# EAGLE design color sensor (EAGLE 9.4.2)
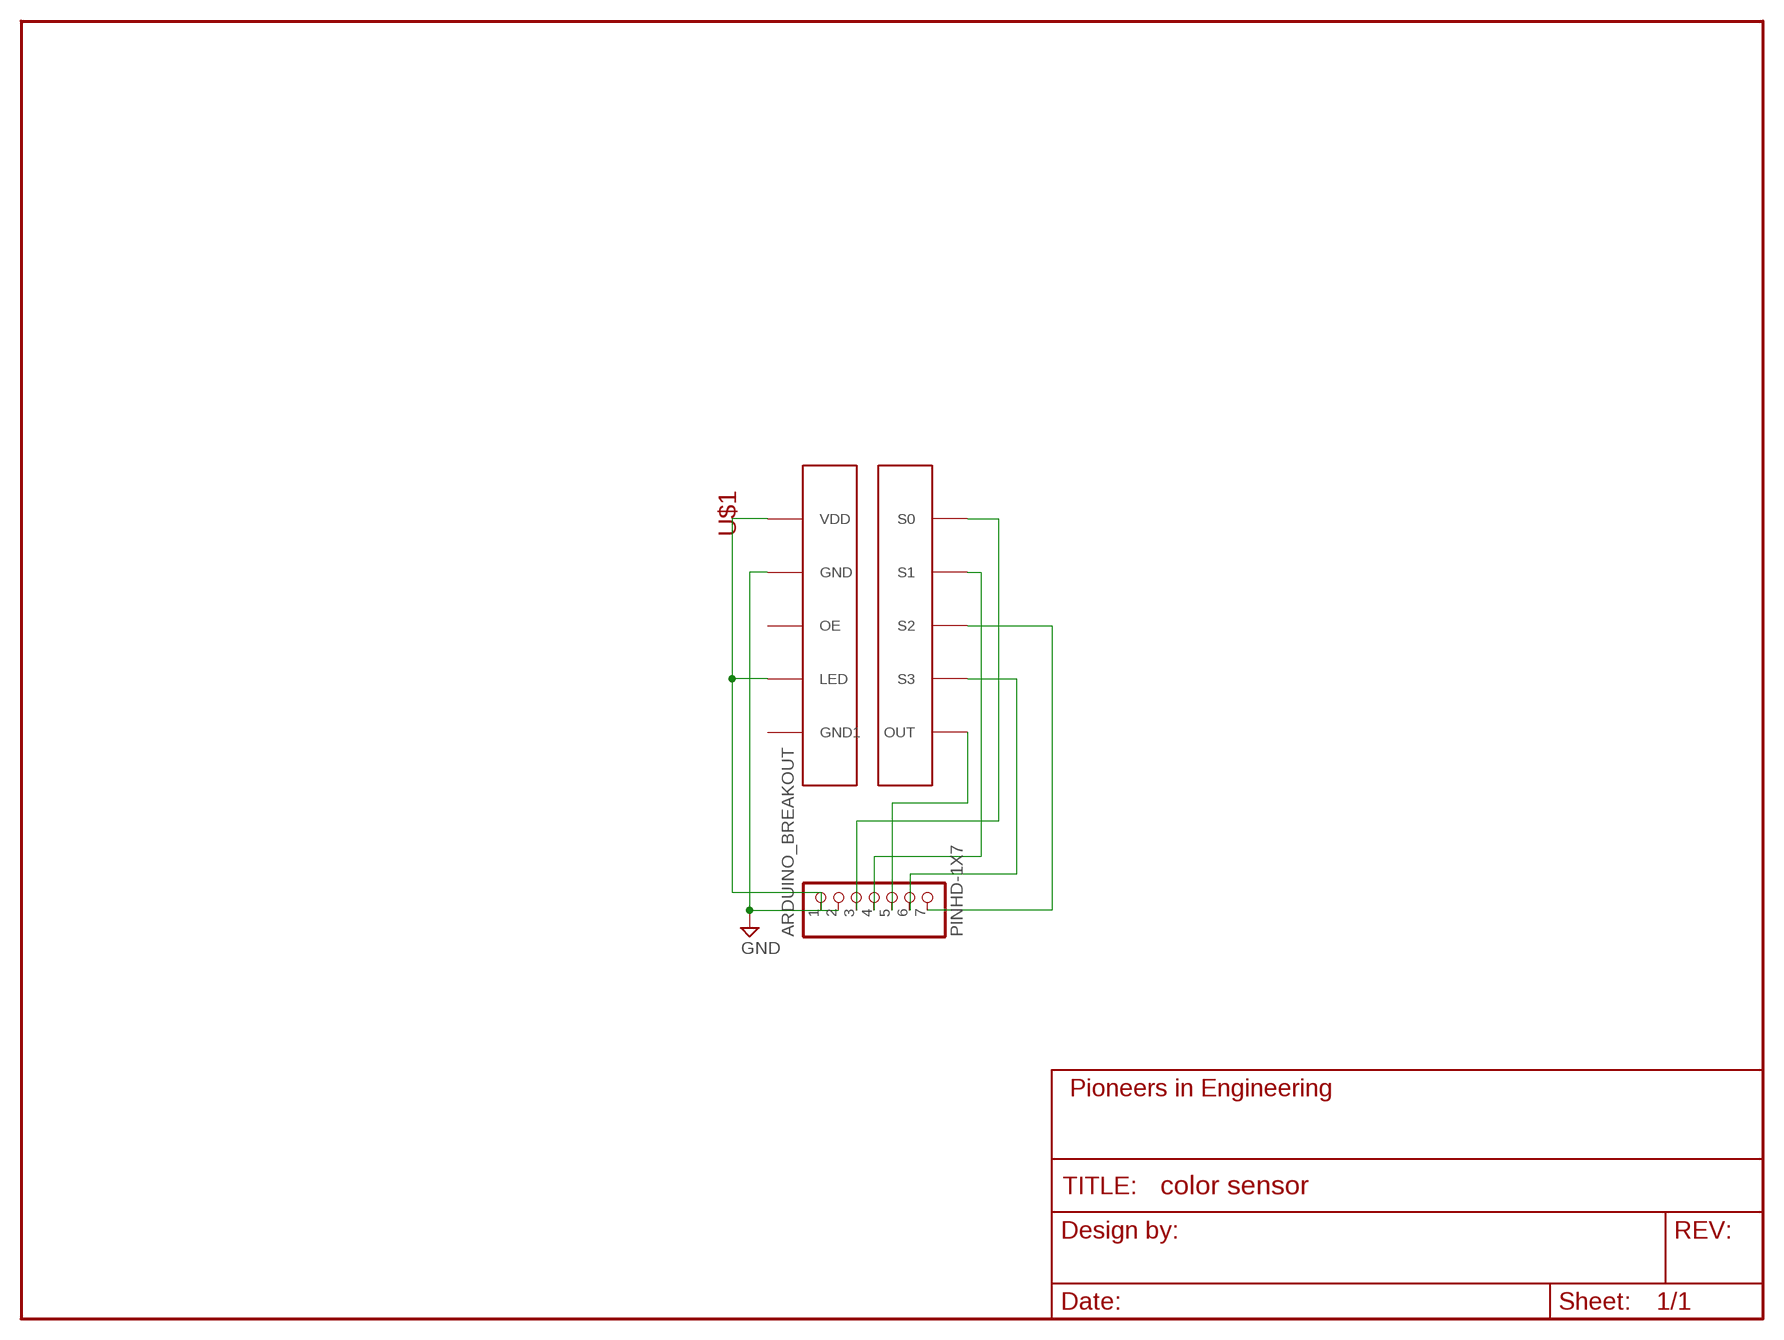
[diagram p0: schematic, sheet 1]

## Parts
ARDUINO_BREAKOUT  PINHD-1X7  [1X07]
U$1  COLOR_SENSOR  [COLOR_SENSOR]

## Nets
GND: ARDUINO_BREAKOUT.2 U$1.P9(GND)
N$1: ARDUINO_BREAKOUT.1 U$1.P7(LED) U$1.P10(VDD)
N$3: ARDUINO_BREAKOUT.3 U$1.P5(S0)
N$4: ARDUINO_BREAKOUT.4 U$1.P4(S1)
N$5: ARDUINO_BREAKOUT.7 U$1.P3(S2)
N$6: ARDUINO_BREAKOUT.6 U$1.P2(S3)
N$7: ARDUINO_BREAKOUT.5 U$1.P1(OUT)
Unconnected: U$1.P6(GND1) U$1.P8(OE)

## Library data of the parts
ARDUINO_BREAKOUT = pie:PINHD-1X7: 7-pin 0.1-inch header; DIGIKEY-PN: 3M9326-ND
U$1 = pie:COLOR_SENSOR: Color sensor

## Board
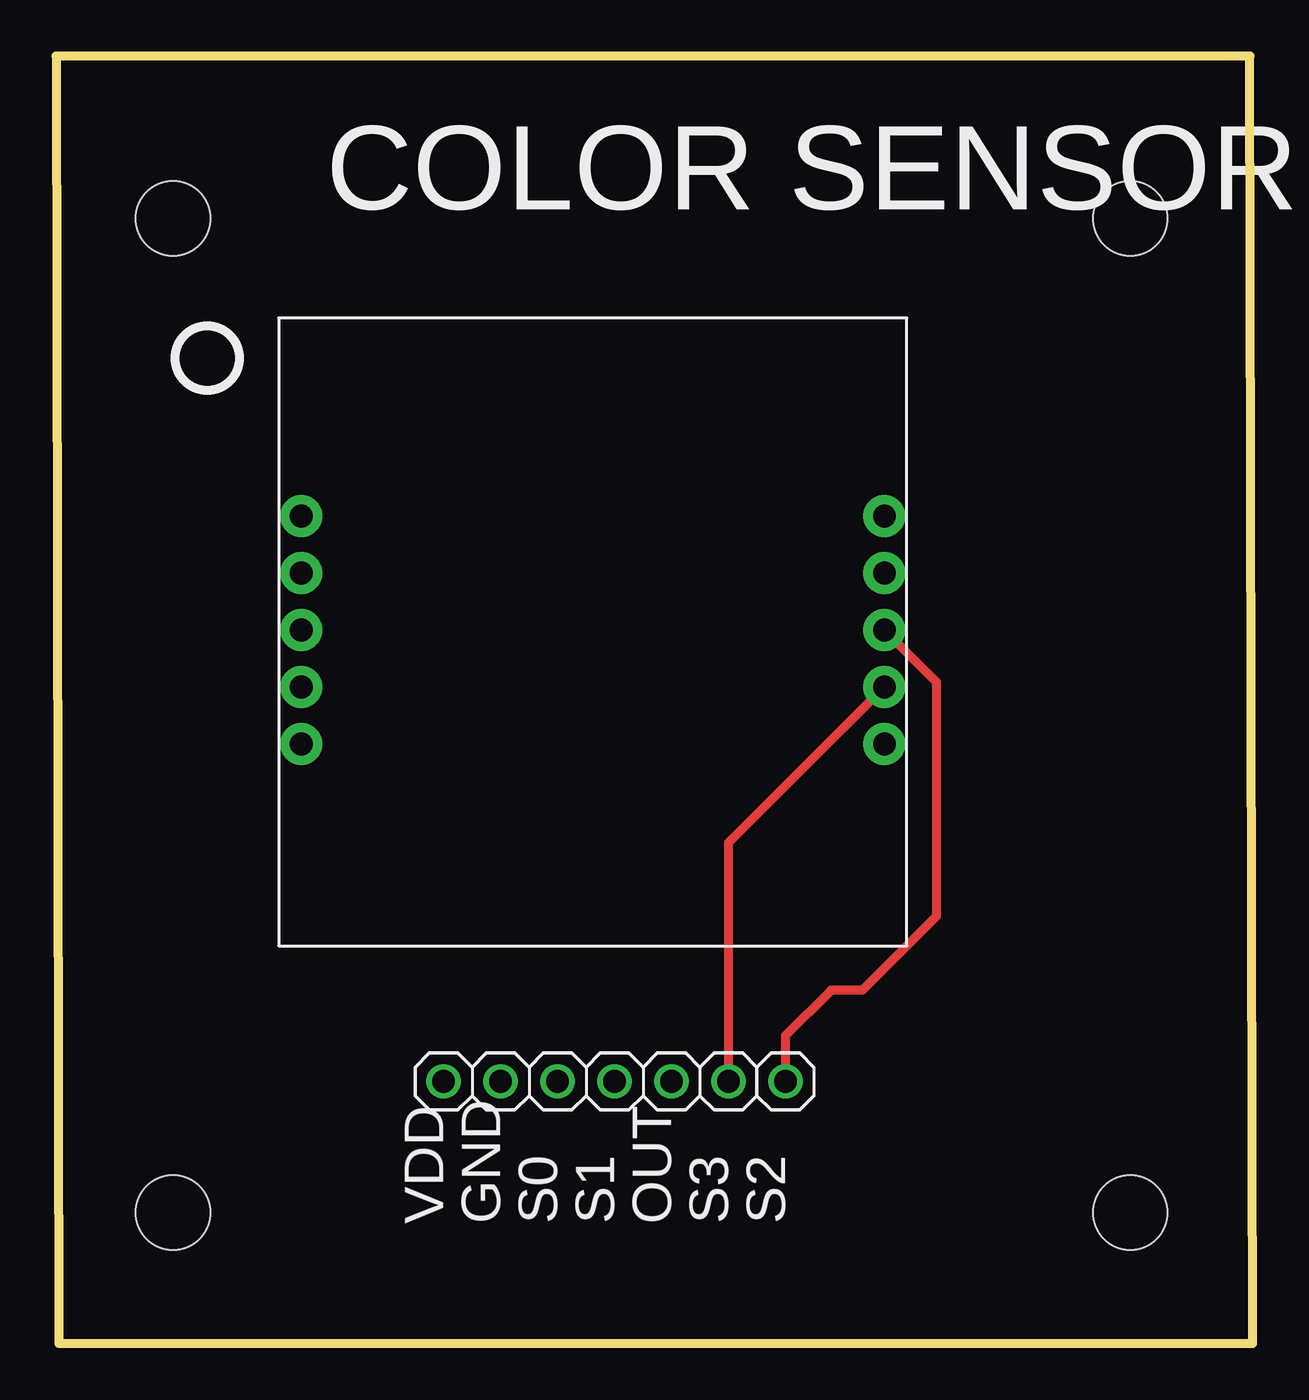
[diagram p1: board, top side]
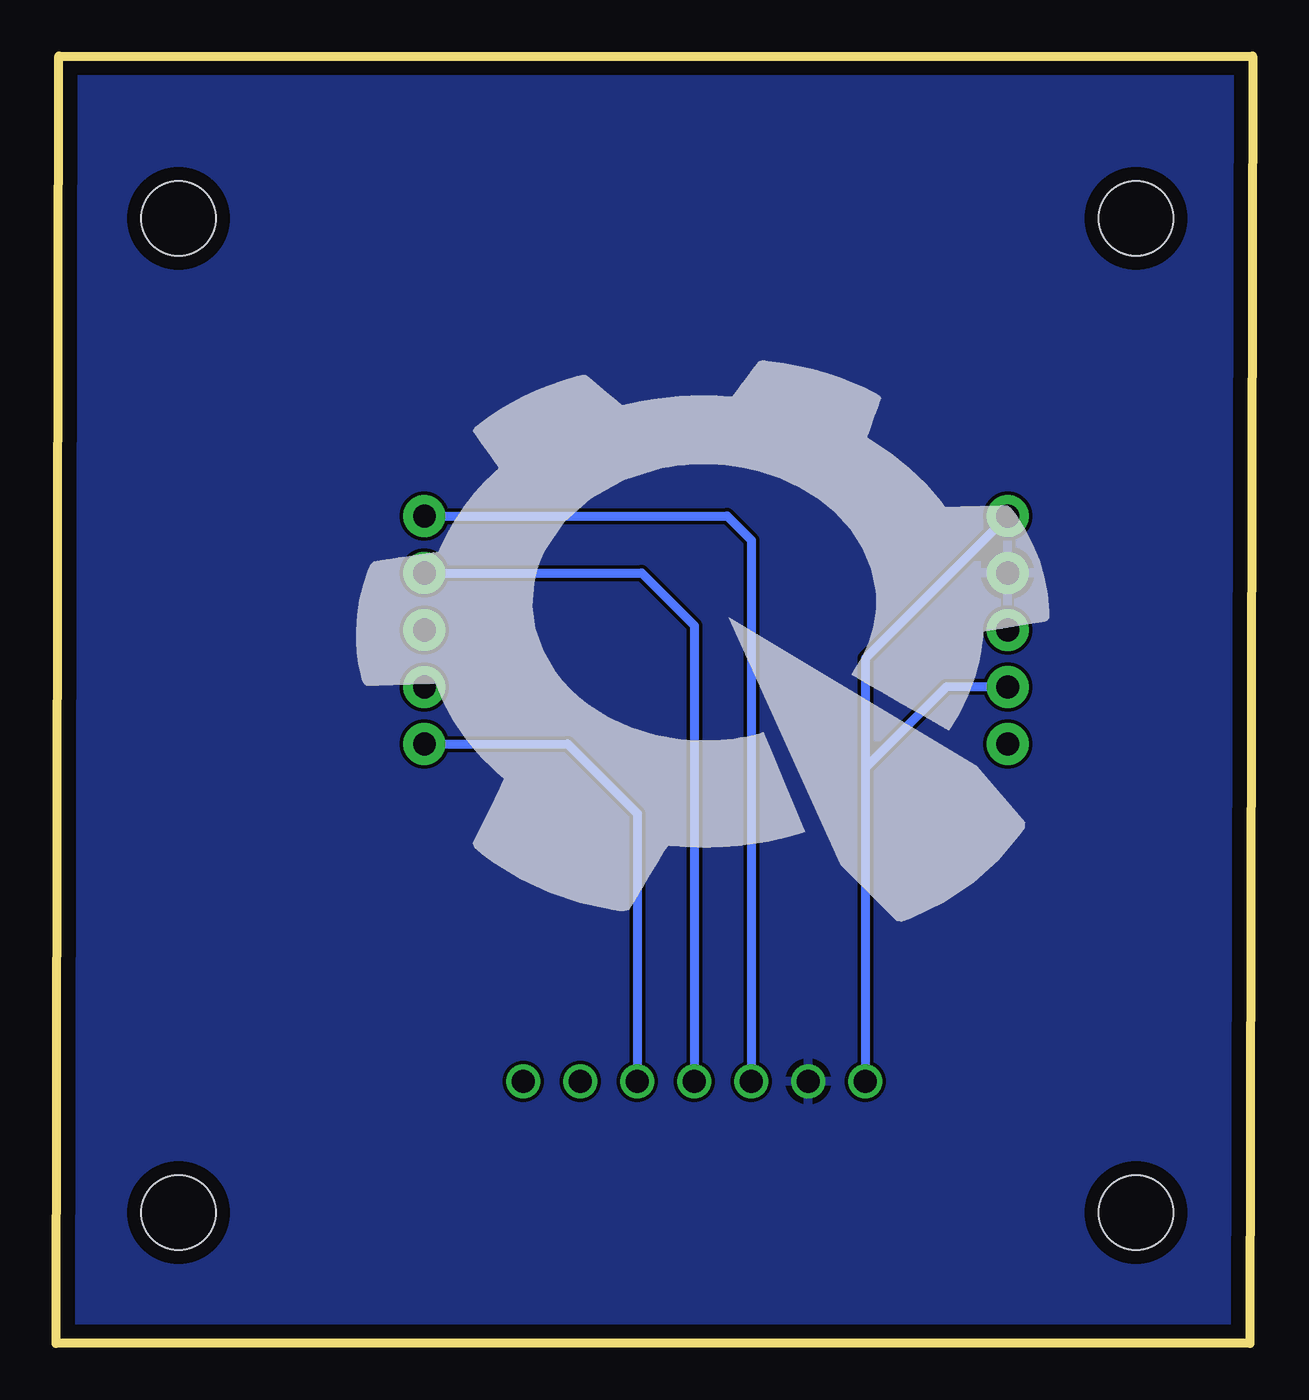
[diagram p2: board, bottom side, seen from below]

Size 53.34 x 57.4 mm. Coordinates in mm from the lower left corner, seen from the top.
Outline: 0,57.4 0.13,0 53.34,0 53.21,57.4 0,57.4
Copper layers (1*16): Top 2mil / dielectric 9mil / Bottom 2mil
Design rules "pie": minimum track width 6mil, minimum drill 15mil, track to track 6mil, track to pad 6mil, pad to pad 6mil, via to via 6mil, smd to smd 6mil, copper to edge 25mil, drill to drill 7mil, minimum pad ring 7mil, minimum via ring 7mil, stop-mask expansion 3mil, vias tented up to drill 21mil, thermal gap 10mil

### Footprints (pad centres in the part's own frame; a part is rotated, then mirrored left to right if it is on the bottom)
1X07 = drill 1.016 pad 1.524: 1 -7.62,0; 2 -5.08,0; 3 -2.54,0; 4 0,0; 5 2.54,0; 6 5.08,0; 7 7.62,0
COLOR_SENSOR = drill 1.016 pad 1.88: P1 26,-4; P2 26,-1.46; P3 26,1.08; P4 26,3.62; P5 26,6.16; P6 0,-4; P7 0,-1.46; P8 0,1.08; P9 0,3.62; P10 0,6.16
STAND-OFF = hole 3.302: 0,0

### Placement (x,y rotation side)
ARDUINO_BREAKOUT  24.89,11.68 0 top
U$1  10.92,30.73 0 top
U$2  [PIE-LOGO]  23.46,32.15 0 bottom
U$3  [STAND-OFF]  5.21,50.16 0 top
U$4  [STAND-OFF]  47.88,50.16 0 top
U$5  [STAND-OFF]  47.88,5.84 0 top
U$6  [STAND-OFF]  5.21,5.84 0 top

### Tracks (layer width: path | path; a pad name or v marks a point on that pad's centre or on a via)
GND
  pour Bottom: -50.04,57.4 99.82,57.4 99.82,-28.96 -50.04,-28.96
N$1
  Bottom 0.406: U$1.P10 17.27,30.54 17.27,25.65 | 17.27,25.65 ARDUINO_BREAKOUT.1 | U$1.P7 13.65,29.27 17.27,25.65
N$3
  Bottom 0.406: U$1.P5 23.43,36.89 22.35,35.81 ARDUINO_BREAKOUT.3
N$4
  Bottom 0.406: U$1.P4 27.24,34.35 24.89,32 ARDUINO_BREAKOUT.4
N$5
  Top 0.406: U$1.P3 39.24,29.49 39.24,19.05 35.94,15.75 34.54,15.75 32.51,13.72 ARDUINO_BREAKOUT.7
N$6
  Top 0.406: U$1.P2 29.97,22.32 ARDUINO_BREAKOUT.6
N$7
  Bottom 0.406: U$1.P1 30.54,26.73 27.43,23.62 ARDUINO_BREAKOUT.5

### Text on the board
tPlace: VDD | GND | S0 | S1 | OUT | S3 | S2